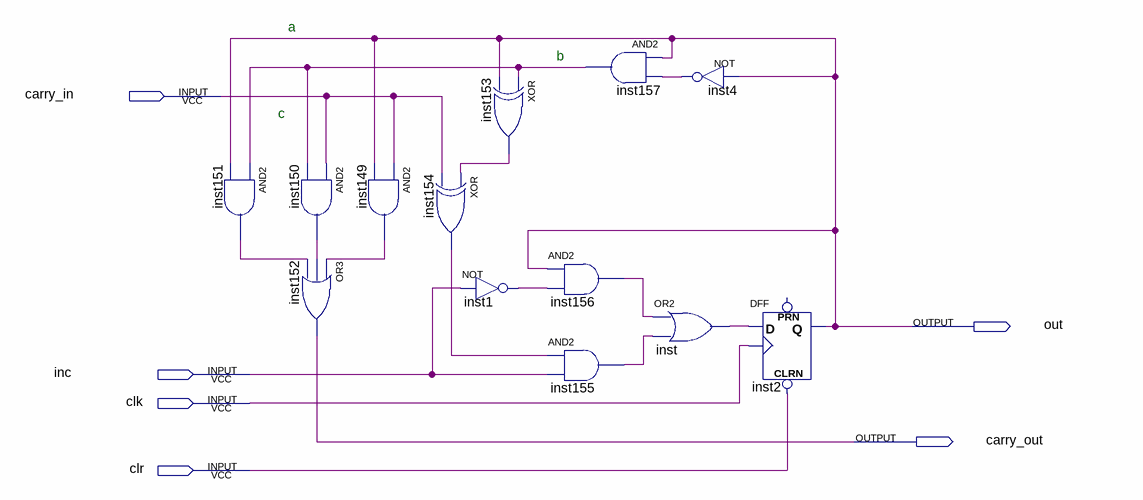
[diagram p0: schematic sheet]
// Quartus schematic adde.bdf as structural Verilog: 13 symbols, 6 pins
module adde (
  input  carry_in,
  input  inc,
  input  clk,
  input  clr,
  output out,
  output carry_out
);

  wire inst1_out, inst4_out, inst149_out, inst150_out, inst151_out, inst153_out, inst154_out, inst155_out,
       inst156_out, inst157_out, inst_out;

  and inst151 (inst151_out, inst157_out, out);
  and inst150 (inst150_out, carry_in, inst157_out);
  or inst152 (carry_out, inst149_out, inst150_out, inst151_out);
  and inst149 (inst149_out, carry_in, out);
  xor inst154 (inst154_out, inst153_out, carry_in);
  not inst1 (inst1_out, inc);
  xor inst153 (inst153_out, inst157_out, out);
  and inst157 (inst157_out, out, inst4_out);
  and inst156 (inst156_out, out, inst1_out);
  and inst155 (inst155_out, inst154_out, inc);
  not inst4 (inst4_out, out);
  or inst (inst_out, inst156_out, inst155_out);
  DFF inst2 (.CLRN(clr), .CLK(clk), .D(inst_out), .Q(out));  // open: PRN

  // Notes on the sheet:
  //   a
  //   b
  //   c
endmodule
